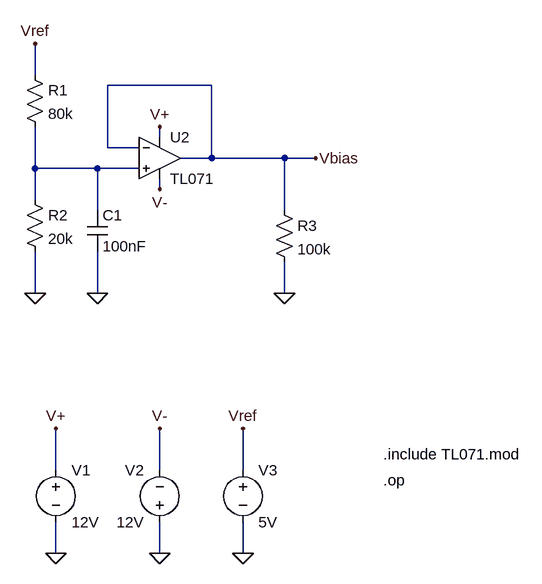
[diagram p0: schematic BiasBuffer.asc]
BiasBuffer.asc, the LTspice schematic file:
Version 4
SHEET 1 1144 1588
WIRE -272 -96 -272 -144
WIRE 0 -80 -160 -80
WIRE -80 0 -80 -16
WIRE -160 16 -160 -80
WIRE -112 16 -160 16
WIRE 0 32 0 -80
WIRE 0 32 -48 32
WIRE 112 32 0 32
WIRE 160 32 112 32
WIRE -272 48 -272 -16
WIRE -176 48 -272 48
WIRE -112 48 -176 48
WIRE -80 80 -80 64
WIRE -272 96 -272 48
WIRE -176 112 -176 48
WIRE 112 112 112 32
WIRE -272 240 -272 176
WIRE -176 240 -176 176
WIRE 112 240 112 192
WIRE -240 512 -240 448
WIRE -80 512 -80 448
WIRE 48 512 48 448
WIRE -240 640 -240 592
WIRE -80 640 -80 592
WIRE 48 640 48 592
FLAG -240 640 0
FLAG -80 640 0
FLAG -240 448 V+
FLAG -80 -16 V+
FLAG -80 448 V-
FLAG -80 80 V-
FLAG 48 640 0
FLAG 48 448 Vref
FLAG -272 -144 Vref
FLAG -272 240 0
FLAG 112 240 0
FLAG 160 32 Vbias
FLAG -176 240 0
SYMBOL voltage -240 496 R0
SYMATTR InstName V1
SYMATTR Value 12V
SYMBOL voltage -80 608 R180
WINDOW 0 24 96 Left 2
WINDOW 3 24 16 Left 2
SYMATTR InstName V2
SYMATTR Value 12V
SYMBOL Opamps\\opamp2 -80 -32 R0
SYMATTR InstName U2
SYMATTR Value TL071
SYMBOL voltage 48 496 R0
SYMATTR InstName V3
SYMATTR Value 5V
SYMBOL res -288 -112 R0
SYMATTR InstName R1
SYMATTR Value 80k
SYMBOL res -288 80 R0
SYMATTR InstName R2
SYMATTR Value 20k
SYMBOL res 96 96 R0
SYMATTR InstName R3
SYMATTR Value 100k
SYMBOL cap -192 112 R0
SYMATTR InstName C1
SYMATTR Value 100nF
TEXT 264 488 Left 2 !.include TL071.mod
TEXT 264 528 Left 2 !.op

The netlist it stands for:
* BiasBuffer.asc
V1 V+ 0 12V
V2 0 V- 12V
XU2 N001 Vbias V+ V- Vbias TL071  ; pins In+ In- V+ V- OUT
V3 Vref 0 5V
R1 Vref N001 80k
R2 N001 0 20k
R3 Vbias 0 100k
C1 N001 0 100nF
.include TL071.mod
.op
.backanno
.end